# EAGLE design uControl_v1 (EAGLE 6.4)
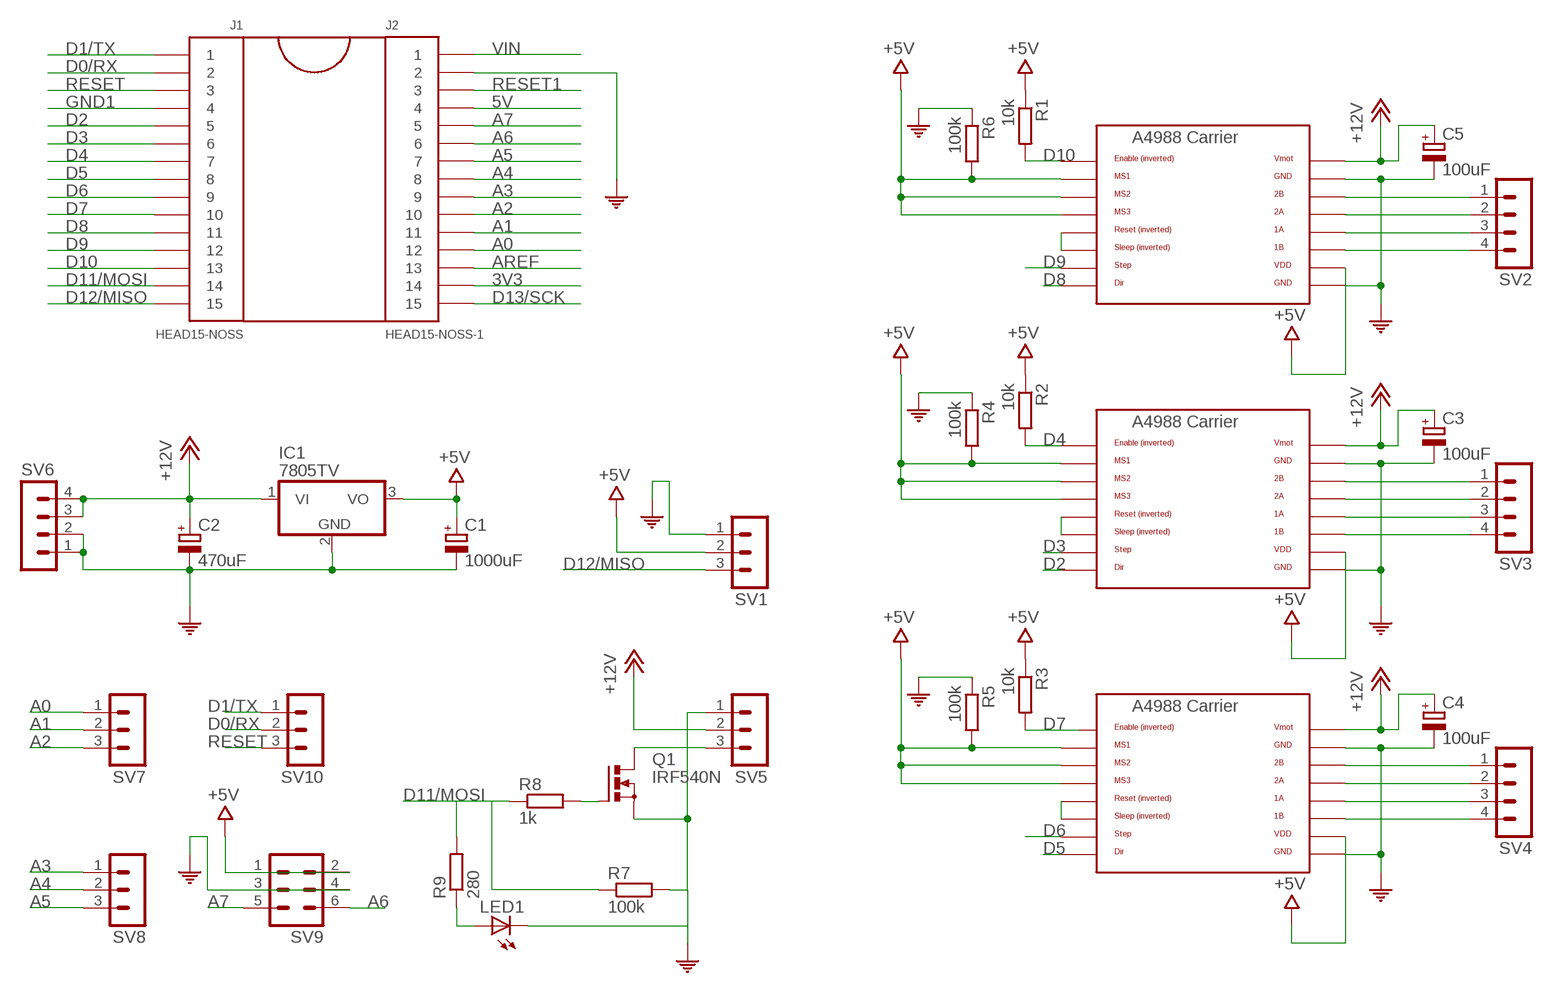
[diagram p0: schematic, sheet 1]

## Parts
C1  1000uF  CPOL-EUTAP5-70  [TAP5-70]
C2  470uF  CPOL-EUTAP5-70  [TAP5-70]
C3  100uF  CPOL-EUTAP5-70  [TAP5-70]
C4  100uF  CPOL-EUTAP5-70  [TAP5-70]
C5  100uF  CPOL-EUTAP5-70  [TAP5-70]
IC1  7805TV  [TO220V]
J1  HEAD15-NOSS  [HEAD15-NOSS]
J2  HEAD15-NOSS-1  [HEAD15-NOSS-1]
LED1  LED3MM  [LED3MM]
Q1  IRF540N  PMOSFET_NTO220BV  [TO220BV]
R1  10k  R-EU_0207/10  [0207/10]
R2  10k  R-EU_0207/10  [0207/10]
R3  10k  R-EU_0207/10  [0207/10]
R4  100k  R-EU_0207/10  [0207/10]
R5  100k  R-EU_0207/10  [0207/10]
R6  100k  R-EU_0207/10  [0207/10]
R7  100k  R-EU_0207/10  [0207/10]
R8  1k  R-EU_0207/10  [0207/10]
R9  280  R-EU_0207/10  [0207/10]
SV1  MA03-1  [MA03-1]
SV2  MA04-1  [MA04-1]
SV3  MA04-1  [MA04-1]
SV4  MA04-1  [MA04-1]
SV5  MA03-1  [MA03-1]
SV6  MA04-1  [MA04-1]
SV7  MA03-1  [MA03-1]
SV8  MA03-1  [MA03-1]
SV9  MA03-2  [MA03-2]
SV10  MA03-1  [MA03-1]
U$3  POLOLU_A4983CARRIER  [A4988BREAKOUT]
U$4  A4988BREAKOUT  [A4988BREAKOUT]
U$5  A4988BREAKOUT  [A4988BREAKOUT]

## Nets
3V3: J2.14
5V: J2.4
+5V: C1.+ IC1.3(VO) R1.1 R2.1 R3.1 R4.2 R5.2 R6.2 SV1.2 SV9.1 SV9.2 U$3.MS1 U$3.MS2 U$3.MS3 U$3.VDD U$4.MS1 U$4.MS2 U$4.MS3 U$4.VDD U$5.MS1 U$5.MS2 U$5.MS3 U$5.VDD
+12V: C2.+ C3.+ C4.+ C5.+ IC1.1(VI) SV5.2 SV6.3 SV6.4 U$3.VMOT U$4.VMOT U$5.VMOT
A0: J2.12 SV7.1
A1: J2.11 SV7.2
A2: J2.10 SV7.3
A3: J2.9 SV8.1
A4: J2.8 SV8.2
A5: J2.7 SV8.3
A6: J2.6 SV9.6
A7: J2.5 SV9.5
AREF: J2.13
COM: C1.- C2.- C3.- C4.- C5.- IC1.2(GND) J2.2 LED1.K(C) Q1.S R4.1 R5.1 R6.1 R7.2 SV1.1 SV5.1 SV6.1 SV6.2 SV9.3 SV9.4 U$3.GND U$3.GND@0(GND) U$4.GND U$4.GND@0(GND) U$5.GND U$5.GND@0(GND)
D0/RX: J1.2 SV10.2
D1/TX: J1.1 SV10.1
D2: J1.5 U$5.DIR
D3: J1.6 U$5.STEP
D4: J1.7 R2.2 U$5.EN
D5: J1.8 U$4.DIR
D6: J1.9 U$4.STEP
D7: J1.10 R3.2 U$4.EN
D8: J1.11 U$3.DIR
D9: J1.12 U$3.STEP
D10: J1.13 R1.2 U$3.EN
D11/MOSI: J1.14 R7.1 R8.1 R9.2
D12/MISO: J1.15 SV1.3
D13/SCK: J2.15
GND1: J1.4
N$1: LED1.A R9.1
N$4: U$4.RST U$4.SLP(SLEEP)
N$5: SV2.1 U$3.2B
N$6: U$3.RST U$3.SLP(SLEEP)
N$7: U$5.RST U$5.SLP(SLEEP)
N$8: SV2.2 U$3.2A
N$10: SV2.3 U$3.1A
N$11: SV2.4 U$3.1B
N$12: SV3.1 U$5.2B
N$13: SV3.2 U$5.2A
N$14: SV3.3 U$5.1A
N$15: SV3.4 U$5.1B
N$16: SV4.1 U$4.2B
N$17: SV4.2 U$4.2A
N$18: SV4.3 U$4.1A
N$19: SV4.4 U$4.1B
N$20: Q1.D SV5.3
N$21: Q1.G R8.2
RESET: J1.3 SV10.3
RESET1: J2.3
VIN: J2.1

## Library data of the parts
C1-C5 = resistor:CPOL-EU: POLARIZED CAPACITOR, European symbol
IC1 = linear:78*: Positive VOLTAGE REGULATOR Source: http://cache.national.com/ds/LM/LM78L05.pdf http://www.fairchildsemi.com/ds/LM/LM7805.pdf
J1 = MyCON2:HEAD15-NOSS
J2 = MyCON2:HEAD15-NOSS-1
LED1 = led:LED: LED OSRAM: - CHIPLED LG R971, LG N971, LY N971, LG Q971, LY Q971, LO R971, LY R971 LH N974, LH R974 LS Q976, LO Q976, LY Q976 LO Q996 - Hyper CHIPLED LW Q18S LB Q993, LB Q99A, LB R99A - SideLED LS A670, LO A670, LY A670, LG A670, LP A670 LB A673, LV A673, LT A673, LW A673 LH A674 LY A675 LS A676, LA A676, LO A676, LY A676, LW A676 LS A679, LY A679, LG A679 - Hyper Micro SIDELED® LS Y876, LA Y876, LO Y876, LY Y876 LT Y87S - SmartLED LW L88C, LW L88S LB L89C, LB L89S, LG L890 LS L89K, LO L89K, LY L89K LS L896, LA L896, LO L896, LY L896 - TOPLED LS T670, LO T670, LY T670, LG T670, LP T670 LSG T670, LSP T670, LSY T670, LOP T670, LYG T670 LG T671, LOG T671, LSG T671 LB T673, LV T673, LT T673, LW T673 LH T674 LS T676, LA T676, LO T676, LY T676, LB T676, LH T676, LSB T676, LW T676 LB T67C, LV T67C, LT T67C, LS T67K, LO T67K, LY T67K, LW E67C LS E67B, LA E67B, LO E67B, LY E67B, LB E67C, LV E67C, LT E67C LW T67C LS T679, LY T679, LG T679 LS T770, LO T770, LY T770, LG T770, LP T770 LB T773, LV T773, LT T773, LW T773 LH T774 LS E675, LA E675, LY E675, LS T675 LS T776, LA T776, LO T776, LY T776, LB T776 LHGB T686 LT T68C, LB T68C - Hyper Mini TOPLED® LB M676 - Mini TOPLED Santana® LG M470 LS M47K, LO M47K, LY M47K Source: http://www.osram.convergy.de LUXEON: - LUMILED® LXK2-PW12-R00, LXK2-PW12-S00, LXK2-PW14-U00, LXK2-PW14-V00 LXK2-PM12-R00, LXK2-PM12-S00, LXK2-PM14-U00 LXK2-PE12-Q00, LXK2-PE12-R00, LXK2-PE12-S00, LXK2-PE14-T00, LXK2-PE14-U00 LXK2-PB12-K00, LXK2-PB12-L00, LXK2-PB12-M00, LXK2-PB14-N00, LXK2-PB14-P00, LXK2-PB14-Q00 LXK2-PR12-L00, LXK2-PR12-M00, LXK2-PR14-Q00, LXK2-PR14-R00 LXK2-PD12-Q00, LXK2-PD12-R00, LXK2-PD12-S00 LXK2-PH12-R00, LXK2-PH12-S00 LXK2-PL12-P00, LXK2-PL12-Q00, LXK2-PL12-R00 Source: www.luxeon.com KINGBRIGHT: KA-3528ASYC Source: www.kingbright.com
Q1 = transistor-power:PMOSFET_N: Power MOSFET N-Channel
R1-R9 = resistor:R-EU_: RESISTOR, European symbol
SV1 SV5 SV7 SV8 SV10 = con-lstb:MA03-1: PIN HEADER; OC_FARNELL: unknown; OC_NEWARK: unknown
SV2-SV4 SV6 = con-lstb:MA04-1: PIN HEADER; OC_FARNELL: unknown; OC_NEWARK: unknown
SV9 = con-lstb:MA03-2: PIN HEADER; OC_FARNELL: unknown; OC_NEWARK: unknown
U$3 = RepRapjr:POLOLU_A4983CARRIER
U$4 U$5 = RepRapjr:A4988BREAKOUT

## Board
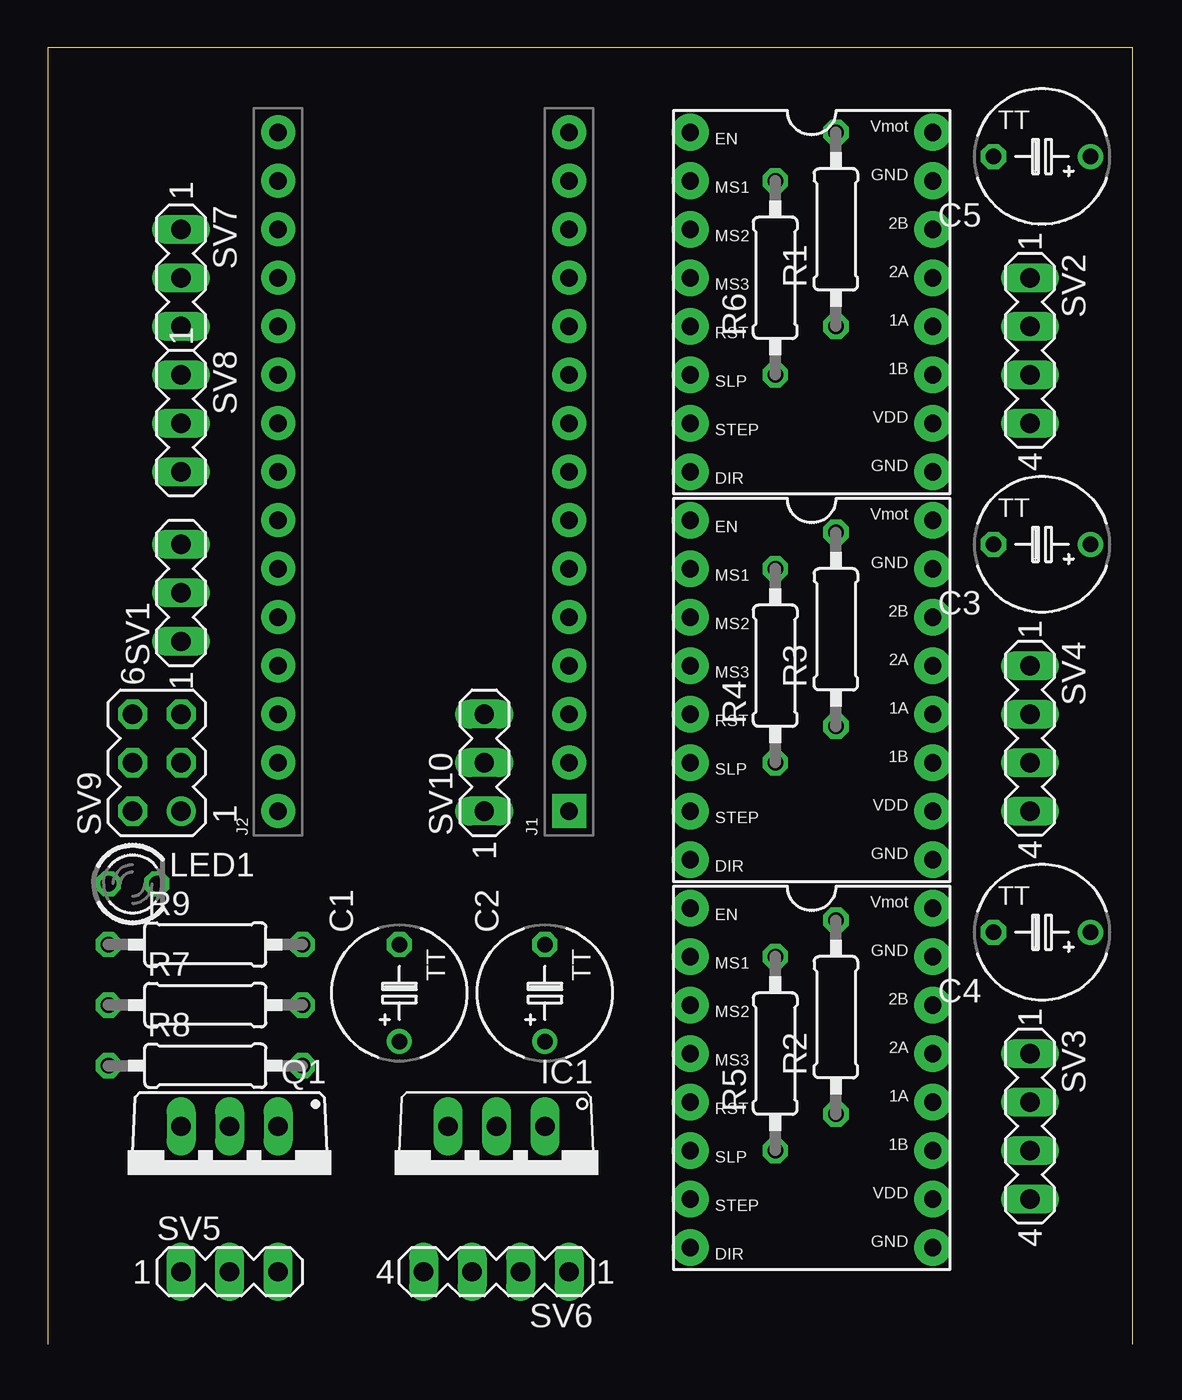
[diagram p1: board, top side]
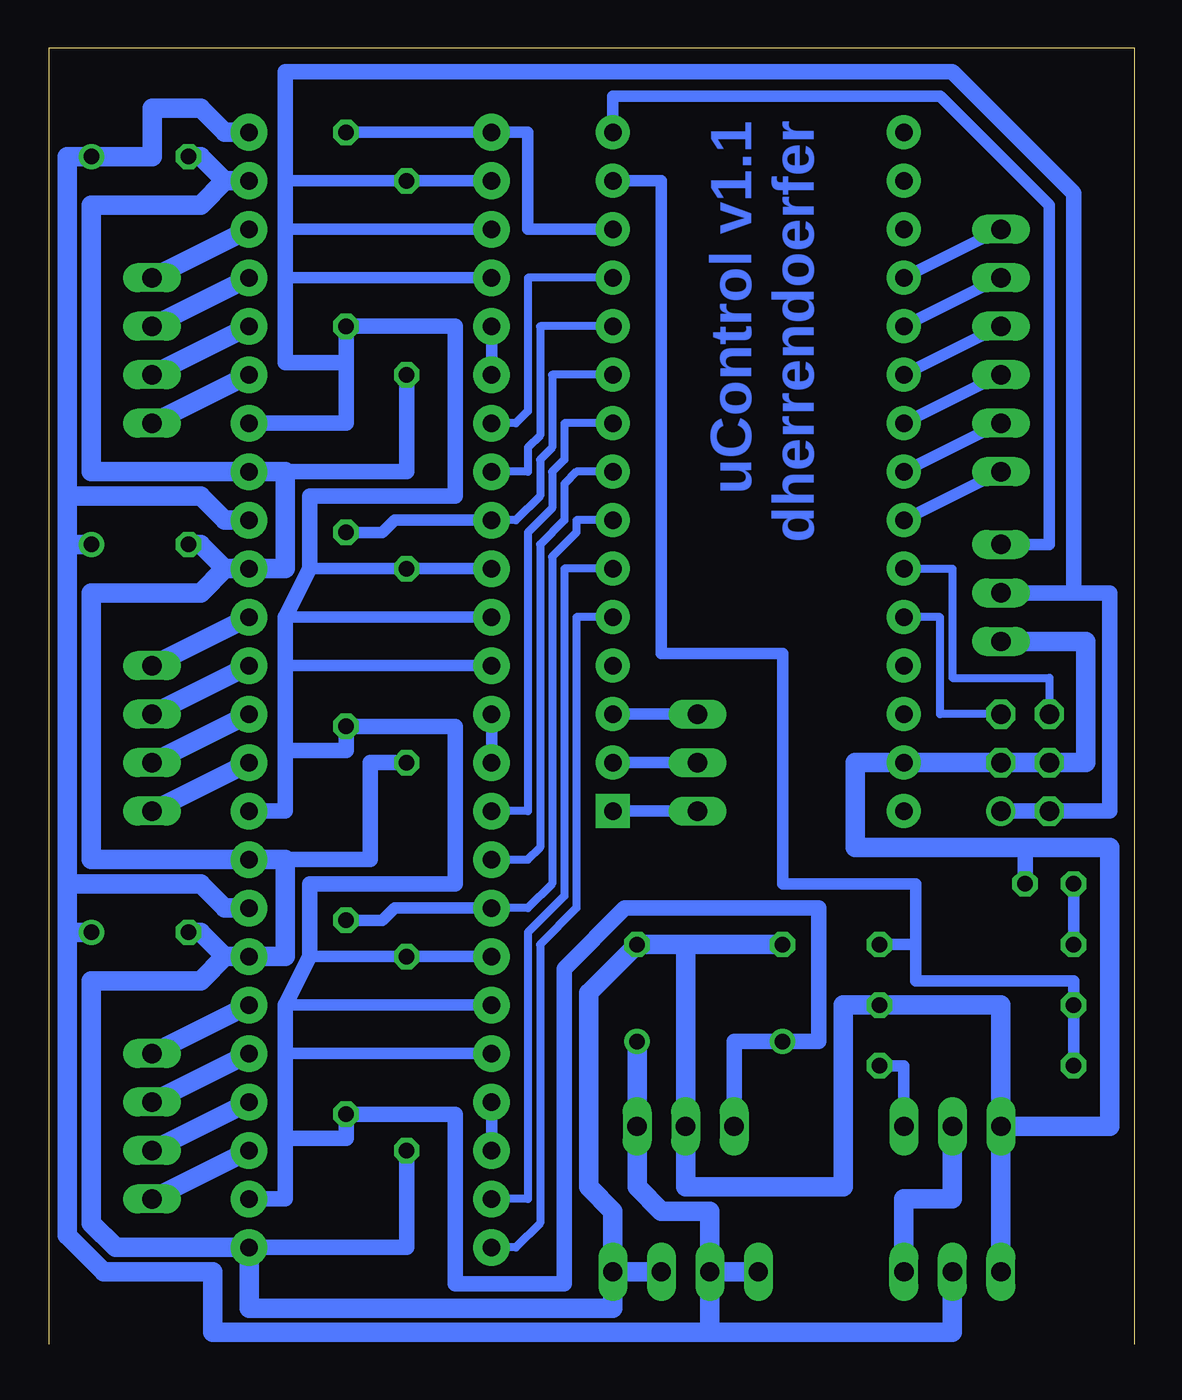
[diagram p2: board, bottom side, seen from below]

Size 56.82 x 67.94 mm. Coordinates in mm from the lower left corner, seen from the top.
Outline: 56.82,0 56.82,67.94 0,67.94 0,0
Copper layers (1*16): Top 0.035mm / dielectric 1.5mm / Bottom 0.035mm
Design rules "default *": minimum track width 10mil, minimum drill 0.6mm, track to track 8mil, track to pad 8mil, pad to pad 8mil, via to via 8mil, smd to smd 8mil, copper to edge 40mil, drill to drill 8mil, minimum pad ring 10mil, minimum via ring 8mil, stop-mask expansion 4mil, vias tented up to drill 0mil, thermal gap 10mil

### Footprints (pad centres in the part's own frame; a part is rotated, then mirrored left to right if it is on the bottom)
TAP5-70 = drill 0.813: + -2.54,0 | drill 0.813 octagon: - 2.54,0
TO220V = drill 1.016 long: 1 -2.54,-2.54; 2 0,-2.54; 3 2.54,-2.54
HEAD15-NOSS = drill 0.914 pad 1.778 square: 1 0,0 | drill 0.914 pad 1.778: 2 2.54,0; 3 5.08,0; 4 7.62,0; 5 10.16,0; 6 12.7,0; 7 15.24,0; 8 17.78,0; 9 20.32,0; 10 22.86,0; 11 25.4,0; 12 27.94,0; 13 30.48,0; 14 33.02,0; 15 35.56,0
HEAD15-NOSS-1 = drill 0.914 pad 1.778: 1 0,0; 2 2.54,0; 3 5.08,0; 4 7.62,0; 5 10.16,0; 6 12.7,0; 7 15.24,0; 8 17.78,0; 9 20.32,0; 10 22.86,0; 11 25.4,0; 12 27.94,0; 13 30.48,0; 14 33.02,0; 15 35.56,0
LED3MM = drill 0.813 octagon: A -1.27,0; K 1.27,0
TO220BV = drill 1.016 long: D 0,-2.54; G -2.54,-2.54; S 2.54,-2.54
0207/10 = drill 0.813 octagon: 1 -5.08,0; 2 5.08,0
MA03-1 = drill 1.016 long: 1 -2.54,0; 2 0,0; 3 2.54,0
MA04-1 = drill 1.016 long: 1 -3.81,0; 2 -1.27,0; 3 1.27,0; 4 3.81,0
MA03-2 = drill 1.016: 1 -2.54,-1.27 | drill 1.016 octagon: 2 -2.54,1.27; 3 0,-1.27; 4 0,1.27; 5 2.54,-1.27; 6 2.54,1.27
A4988BREAKOUT = drill 0.9 pad 1.93: 1A 8.89,1.27; 1B 11.43,1.27; 2A 6.35,1.27; 2B 3.81,1.27; DIR 16.51,-11.43; EN -1.27,-11.43; GND 16.51,1.27; GND@0 1.27,1.27; MS1 1.27,-11.43; MS2 3.81,-11.43; MS3 6.35,-11.43; RST 8.89,-11.43; SLP 11.43,-11.43; STEP 13.97,-11.43; VDD 13.97,1.27; VMOT -1.27,1.27

### Placement (x,y rotation side)
C1  18.41,18.41 90 top
C2  26.04,18.41 90 top
C3  52.07,41.91 180 top
C4  52.07,21.59 180 top
C5  52.07,62.23 180 top
IC1  23.5,8.89 180 top
J1  27.3,27.94 90 top
J2  12.06,27.94 90 top
LED1  4.45,24.13 0 top
Q1  9.53,8.89 180 top
R1  41.27,58.42 90 top
R2  41.27,17.14 90 top
R3  41.27,37.47 90 top
R4  38.1,35.56 90 top
R5  38.1,15.24 90 top
R6  38.1,55.88 90 top
R7  8.26,17.78 0 top
R8  8.26,14.61 0 top
R9  8.26,20.95 0 top
SV1  6.99,39.37 90 top
SV2  51.44,52.07 270 top
SV3  51.44,11.43 270 top
SV4  51.44,31.75 270 top
SV5  9.53,3.81 0 top
SV6  23.5,3.81 180 top
SV7  6.99,55.88 270 top
SV8  6.99,48.26 270 top
SV9  5.71,30.48 90 top
SV10  22.86,30.48 90 top
U$3  45.09,62.23 270 top
U$4  45.09,41.91 270 top
U$5  45.09,21.59 270 top

### Tracks (layer width: path | path; a pad name or v marks a point on that pad's centre or on a via)
+5V
  Bottom 0.61: U$5.MS1 R5.2 43.18,20.32 | U$5.MS2 44.45,17.78 | U$5.MS3 44.45,15.24 | U$4.MS1 R4.2 43.18,40.64 | U$4.MS2 44.45,38.1 | U$4.MS3 44.45,35.56 | 44.45,60.96 R6.2 U$3.MS1 | U$3.MS3 44.45,55.88 | U$3.MS2 44.45,58.42
  Bottom 0.813: 44.45,10.79 44.45,15.24 44.45,17.78 43.18,20.32 43.18,24.13 35.56,24.13 35.56,32.38 R3.1 41.27,31.11 44.45,31.11 | 44.45,10.79 44.45,7.62 U$5.VDD | 44.45,31.11 44.45,35.56 44.45,38.1 43.18,40.64 43.18,44.45 35.56,44.45 35.56,53.34 R1.1 41.27,51.44 | 44.45,31.11 44.45,27.94 U$4.VDD | 41.27,51.44 41.27,48.26 U$3.VDD | 44.45,10.79 41.27,10.79 R2.1 35.56,12.06 35.56,3.17 29.84,3.17 29.84,19.68 26.67,22.86 16.51,22.86 16.51,15.88 C1.+ 20.95,15.88 IC1.3 | SV9.1 SV9.2 1.27,27.94 1.27,39.37 3.17,39.37 | 41.27,51.44 44.45,51.44 44.45,55.88 44.45,58.42 44.45,60.96 44.45,66.67 9.53,66.67 3.17,60.33 3.17,39.37 | 3.17,39.37 SV1.2
+12V
  Bottom 0.406: IC1.1 C2.+
  Bottom 1.016: SV6.4 SV6.3 | 55.88,44.45 55.88,62.23 C5.+ 51.44,62.23 51.44,64.77 48.9,64.77 47.62,63.5 U$3.VMOT | 55.88,44.45 55.88,41.91 | 55.88,41.91 55.88,24.13 | 55.88,24.13 55.88,21.59 | SV6.3 22.23,6.99 24.77,6.99 26.04,8.26 C2.+ | 22.23,0.64 48.26,0.64 48.26,3.81 53.98,3.81 55.88,5.71 55.88,21.59 | 22.23,0.64 SV6.3 | SV5.2 9.53,0.64 22.23,0.64 | C3.+ 55.88,41.91 | U$4.VMOT 47.62,43.18 48.9,44.45 55.88,44.45 | U$5.VMOT 47.62,22.86 48.9,24.13 55.88,24.13 | C4.+ 55.88,21.59
A0
  Bottom 0.61: SV7.1 J2.12
A1
  Bottom 0.61: J2.11 SV7.2
A2
  Bottom 0.61: SV7.3 J2.10
A3
  Bottom 0.61: J2.9 SV8.1
A4
  Bottom 0.61: SV8.2 J2.8
A5
  Bottom 0.61: SV8.3 J2.7
A6
  Bottom 0.406: J2.6 9.53,40.64 9.53,34.92 4.45,34.92 SV9.6
A7
  Bottom 0.406: SV9.5 10.16,33.02 10.16,38.1 J2.5
COM
  Bottom 0.813: U$5.GND 38.1,5.08 R5.1 | 44.45,25.4 40.01,25.4 40.01,30.48 R4.1 | R6.1 38.1,45.72 44.45,45.72 | LED1.K 5.71,26.04
  Bottom 1.016: C1.- 23.5,20.95 | 23.5,20.95 C2.- 28.57,18.41 28.57,8.26 27.3,6.99 SV6.1 | 23.5,20.95 IC1.2 23.5,8.26 15.24,8.26 15.24,17.78 R7.2 6.99,17.78 Q1.S | SV6.2 SV6.1 | Q1.S SV5.1 | SV6.1 27.3,1.91 46.35,1.91 U$5.GND 53.34,5.08 54.61,6.35 54.61,19.05 48.9,19.05 47.62,20.32 | Q1.S 1.27,11.43 1.27,26.04 5.71,26.04 14.61,26.04 14.61,30.48 J2.2 SV9.3 SV9.4 2.54,30.48 2.54,36.83 SV1.1 | U$3.GND@0 47.62,60.96 | 47.62,60.96 48.9,59.69 54.61,59.69 54.61,45.72 U$3.GND 44.45,45.72 44.45,40.64 U$4.GND@0 47.62,40.64 | 47.62,40.64 48.9,39.37 54.61,39.37 54.61,25.4 U$4.GND 44.45,25.4 44.45,20.32 U$5.GND@0 47.62,20.32 | C5.- 48.9,62.23 47.62,60.96 | C3.- 48.9,41.91 47.62,40.64 | C4.- 48.9,21.59 47.62,20.32
D0/RX
  Bottom 0.61: SV10.2 J1.2
D1/TX
  Bottom 0.61: SV10.1 J1.1
D2
  Bottom 0.406: J1.5 29.21,38.1 29.21,22.86 31.11,20.95 31.11,6.35 32.38,5.08 U$5.DIR
D3
  Bottom 0.406: J1.6 29.84,40.64 29.84,23.5 31.75,21.59 31.75,7.62 U$5.STEP
D4
  Bottom 0.406: J1.7 29.21,43.18 29.21,42.55 30.48,41.27 30.48,24.13 31.75,22.86 U$5.EN
  Bottom 0.61: R2.2 39.37,22.23 38.73,22.86 U$5.EN
D5
  Bottom 0.406: J1.8 29.21,45.72 29.84,45.09 29.84,43.18 31.11,41.91 31.11,26.04 31.75,25.4 U$4.DIR
D6
  Bottom 0.406: J1.9 29.84,48.26 29.84,46.35 30.48,45.72 30.48,43.81 31.75,42.55 31.75,27.94 U$4.STEP
D7
  Bottom 0.406: J1.10 30.48,50.8 30.48,46.99 31.11,46.35 31.11,44.45 32.38,43.18 U$4.EN
  Bottom 0.61: R3.2 39.37,42.55 38.73,43.18 U$4.EN
D8
  Bottom 0.406: J1.11 31.11,53.34 31.11,47.62 31.75,46.99 31.75,45.72 U$3.DIR
D9
  Bottom 0.406: J1.12 31.75,55.88 31.75,48.9 32.38,48.26 U$3.STEP
D10
  Bottom 0.61: J1.13 31.75,58.42 31.75,63.5 U$3.EN R1.2
D11/MOSI
  Bottom 0.61: J1.14 24.77,60.96 24.77,36.2 18.41,36.2 18.41,24.13 11.43,24.13 11.43,20.95 | 11.43,20.95 11.43,19.05 3.17,19.05 R7.1 R8.1 | 11.43,20.95 R9.2
D12/MISO
  Bottom 0.61: J1.15 27.3,65.41 10.16,65.41 4.45,59.69 4.45,41.91 SV1.3
N$1
  Bottom 0.61: LED1.A R9.1
N$4
  Bottom 0.61: U$4.RST U$4.SLP
N$5
  Bottom 1.016: U$3.2B SV2.1
N$6
  Bottom 0.61: U$3.SLP U$3.RST
N$7
  Bottom 0.61: U$5.SLP U$5.RST
N$8
  Bottom 1.016: U$3.2A SV2.2
N$10
  Bottom 1.016: U$3.1A SV2.3
N$11
  Bottom 1.016: U$3.1B SV2.4
N$12
  Bottom 1.016: U$5.2B SV3.1
N$13
  Bottom 1.016: U$5.2A SV3.2
N$14
  Bottom 1.016: U$5.1A SV3.3
N$15
  Bottom 1.016: U$5.1B SV3.4
N$16
  Bottom 1.016: U$4.2B SV4.1
N$17
  Bottom 1.016: U$4.2A SV4.2
N$18
  Bottom 1.016: U$4.1A SV4.3
N$19
  Bottom 1.016: U$4.1B SV4.4
N$20
  Bottom 1.016: Q1.D 9.53,7.62 12.06,7.62 SV5.3
N$21
  Bottom 0.61: Q1.G 12.06,14.61 R8.2
RESET
  Bottom 0.61: SV10.3 J1.3

### Text on the board
Bottom: uControl v1.1 / dherrendoerfer